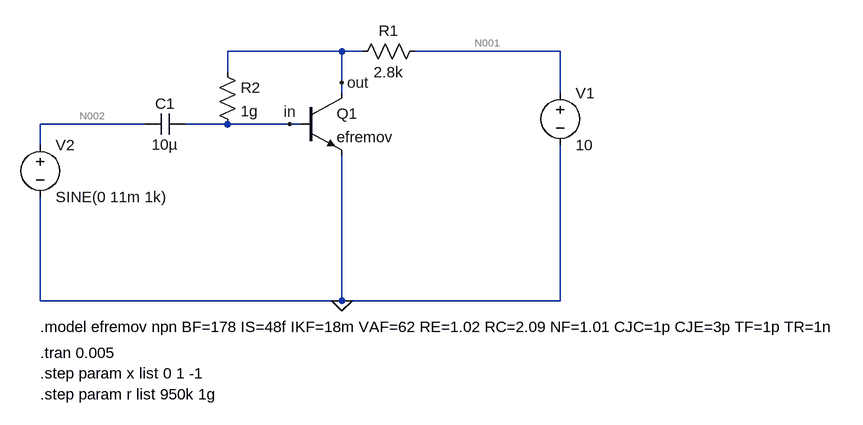
[diagram p0: schematic 2.c.asc]
2.c.asc, the LTspice schematic file:
Version 4
SHEET 1 1164 680
WIRE 208 48 32 48
WIRE 240 48 208 48
WIRE 544 48 320 48
WIRE 32 80 32 48
WIRE 208 96 208 48
WIRE 208 112 208 96
WIRE 544 112 544 48
WIRE -96 160 -256 160
WIRE 32 160 -32 160
WIRE 128 160 32 160
WIRE 144 160 128 160
WIRE -256 192 -256 160
WIRE -256 432 -256 272
WIRE 208 432 208 208
WIRE 208 432 -256 432
WIRE 544 432 544 192
WIRE 544 432 208 432
FLAG 208 432 0
FLAG 208 96 out
FLAG 128 160 in
SYMBOL npn 144 112 R0
SYMATTR InstName Q1
SYMATTR Value efremov
SYMBOL voltage 544 96 R0
WINDOW 123 0 0 Left 2
WINDOW 39 0 0 Left 2
SYMATTR InstName V1
SYMATTR Value 10
SYMBOL res 336 32 R90
WINDOW 0 0 56 VBottom 2
WINDOW 3 32 56 VTop 2
SYMATTR InstName R1
SYMATTR Value 2.8k
SYMBOL res 16 64 R0
SYMATTR InstName R2
SYMATTR Value 1g
SYMBOL voltage -256 176 R0
WINDOW 123 0 0 Left 2
WINDOW 39 0 0 Left 2
SYMATTR InstName V2
SYMATTR Value SINE(0 11m 1k)
SYMBOL cap -32 144 R90
WINDOW 0 0 32 VBottom 2
WINDOW 3 32 32 VTop 2
SYMATTR InstName C1
SYMATTR Value 10µ
TEXT -256 472 Left 2 !.model efremov npn BF=178 IS=48f IKF=18m VAF=62 RE=1.02 RC=2.09 NF=1.01 CJC=1p CJE=3p TF=1p TR=1n
TEXT -256 512 Left 2 !.tran 0.005
TEXT -256 544 Left 2 !.step param x list 0 1 -1
TEXT -256 576 Left 2 !.step param r list 950k 1g

The netlist it stands for:
* 2.c.asc
Q1 out in 0 0 efremov
V1 N001 0 10
R1 N001 out 2.8k
R2 out in 1g
V2 N002 0 SINE(0 11m 1k)
C1 in N002 10µ
.model NPN NPN
.model PNP PNP
.lib standard.bjt
.model efremov npn BF=178 IS=48f IKF=18m VAF=62 RE=1.02 RC=2.09 NF=1.01 CJC=1p CJE=3p TF=1p TR=1n
.tran 0.005
.step param x list 0 1 -1
.step param r list 950k 1g
.backanno
.end

* Results of the author's LTspice run, read from the files saved beside the schematic
* Operating Point (first step), zero values left out:
*   x = -1 
*   V(out) = 9.994 V
*   V(in) = 454.1 mV
*   V(n001) = 10 V
*   Ic(Q1) = 1.961 µA
*   Ib(Q1) = 9.541 nA
*   Ie(Q1) = -1.971 µA
*   I(R2) = 9.54 nA
*   I(R1) = 1.971 µA
*   I(V1) = -1.971 µA
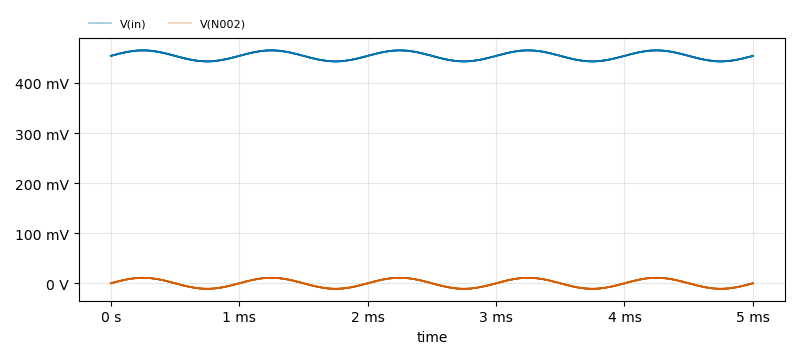
[diagram p1: Transient Analysis of 2.c.asc, plotted from the saved traces]
* Transient Analysis, 11 runs:
*   V(in) [run 1]: min 443.1 mV, max 465.1 mV, average 454.1 mV, rms 454.2 mV, last 454.1 mV
*   V(in) [run 2]: 454.1 mV at time=0 s, 454.1 mV at time=0 s, min 454.1 mV, max 454.1 mV
*   V(in) [run 3]: min 443.1 mV, max 465.1 mV, average 454.1 mV, rms 454.2 mV, last 454.1 mV
*   V(in) [run 4]: 454.1 mV at time=0 s, 454.1 mV at time=0 s, min 454.1 mV, max 454.1 mV
*   V(in) [run 5]: min 443.1 mV, max 465.1 mV, average 454.1 mV, rms 454.2 mV, last 454.1 mV
*   V(in) [run 6]: 454.1 mV at time=0 s, 454.1 mV at time=0 s, min 454.1 mV, max 454.1 mV
*   V(in) [run 7]: min 443.1 mV, max 465.1 mV, average 454.1 mV, rms 454.2 mV, last 454.1 mV
*   V(in) [run 8]: 454.1 mV at time=0 s, 454.1 mV at time=0 s, min 454.1 mV, max 454.1 mV
*   V(N002) [run 1]: min -10.99 mV, max 11 mV, average -57.82 nV, rms 7.793 mV, last 0 V
*   V(N002) [run 2]: 0 V at time=0 s, 0 V at time=0 s, min 0 V, max 0 V
*   V(N002) [run 3]: min -11 mV, max 10.99 mV, average -8.865 nV, rms 7.792 mV, last 0 V
*   V(N002) [run 4]: 0 V at time=0 s, 0 V at time=0 s, min 0 V, max 0 V
*   V(N002) [run 5]: min -11 mV, max 10.99 mV, average -8.865 nV, rms 7.792 mV, last 0 V
*   V(N002) [run 6]: 0 V at time=0 s, 0 V at time=0 s, min 0 V, max 0 V
*   V(N002) [run 7]: min -11 mV, max 10.99 mV, average -8.865 nV, rms 7.792 mV, last 0 V
*   V(N002) [run 8]: 0 V at time=0 s, 0 V at time=0 s, min 0 V, max 0 V